# EAGLE design v001 (EAGLE 6.4)

## Sheet 1 of 2
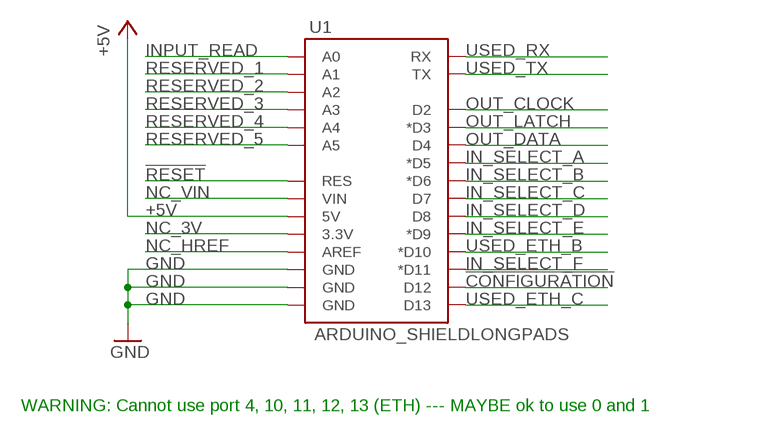
[diagram p0: schematic, sheet 1]

### Parts
U1  ARDUINO_SHIELDLONGPADS  [DUEMILANOVE_SHIELD_LONGPADS]

### Nets
!CONFIGURATION: U1.D12 ; also sheet 2
!RESET: U1.RES ; also sheet 2
+5V: U1.5V ; also sheet 2
GND: U1.GND@0(GND) U1.GND@1(GND) U1.GND@2(GND) ; also sheet 2
IN_SELECT_A: U1.D5(*D5) ; also sheet 2
IN_SELECT_B: U1.D6(*D6) ; also sheet 2
IN_SELECT_C: U1.D7 ; also sheet 2
IN_SELECT_D: U1.D8 ; also sheet 2
IN_SELECT_E: U1.D9(*D9) ; also sheet 2
IN_SELECT_F: U1.D11(*D11) ; also sheet 2
INPUT_READ: U1.A0 ; also sheet 2
NC_3V: U1.3.3V
NC_HREF: U1.AREF
NC_VIN: U1.VIN
OUT_CLOCK: U1.D2 ; also sheet 2
OUT_DATA: U1.D4 ; also sheet 2
OUT_LATCH: U1.D3(*D3) ; also sheet 2
RESERVED_1: U1.A1 ; also sheet 2
RESERVED_2: U1.A2 ; also sheet 2
RESERVED_3: U1.A3 ; also sheet 2
RESERVED_4: U1.A4 ; also sheet 2
RESERVED_5: U1.A5 ; also sheet 2
USED_ETH_B: U1.D10(*D10)
USED_ETH_C: U1.D13
USED_RX: U1.RX
USED_TX: U1.TX

### Notes on the sheet
- WARNING: Cannot use port 4, 10, 11, 12, 13 (ETH) --- MAYBE ok to use 0 and 1

## Sheet 2 of 2
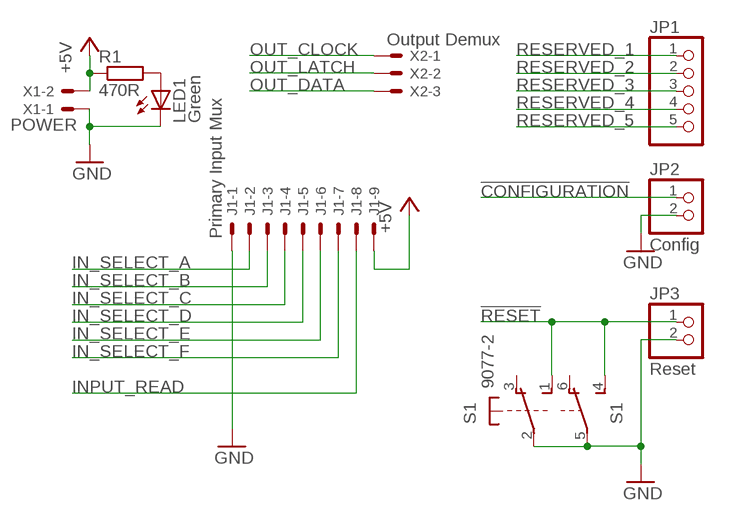
[diagram p1: schematic, sheet 2]

### Parts
J1  Primary Input Mux  22-27-2091-09  [6410-09]
JP1  PINHD-1X5  [1X05]
JP2  Config  PINHD-1X2  [1X02]
JP3  Reset  PINHD-1X2  [1X02]
LED1  Green  LED3MM  [LED3MM]
R1  470R  R-EU_0204/7  [0204/7]
S1  9077-2  [9077-2]
X1  POWER  22-23-2021  [22-23-2021]
X2  Output Demux  22-23-2031  [22-23-2031]

### Nets
!CONFIGURATION: JP2.1 ; also sheet 1
!RESET: JP3.1 S1.1(1:S) S1.4(2:S) ; also sheet 1
+5V: J1.9 R1.1 X1.2 ; also sheet 1
GND: J1.1 JP2.2 JP3.2 LED1.K(C) S1.2(1:P) S1.5(2:P) X1.1 ; also sheet 1
IN_SELECT_A: J1.2 ; also sheet 1
IN_SELECT_B: J1.3 ; also sheet 1
IN_SELECT_C: J1.4 ; also sheet 1
IN_SELECT_D: J1.5 ; also sheet 1
IN_SELECT_E: J1.6 ; also sheet 1
IN_SELECT_F: J1.7 ; also sheet 1
INPUT_READ: J1.8 ; also sheet 1
N$1: LED1.A R1.2
OUT_CLOCK: X2.1 ; also sheet 1
OUT_DATA: X2.3 ; also sheet 1
OUT_LATCH: X2.2 ; also sheet 1
RESERVED_1: JP1.1 ; also sheet 1
RESERVED_2: JP1.2 ; also sheet 1
RESERVED_3: JP1.3 ; also sheet 1
RESERVED_4: JP1.4 ; also sheet 1
RESERVED_5: JP1.5 ; also sheet 1
Unconnected: S1.3(1:O) S1.6(2:O)

## Library data of the parts
J1 = con-molex:22-?-09: CONNECTOR wire to board 2.54 mm (.1 inch) pitch header; OC_FARNELL: unknown; OC_NEWARK: unknown
JP1 = pinhead:PINHD-1X5: PIN HEADER
JP2 JP3 = pinhead:PINHD-1X2: PIN HEADER
LED1 = led:LED: LED OSRAM: - CHIPLED LG R971, LG N971, LY N971, LG Q971, LY Q971, LO R971, LY R971 LH N974, LH R974 LS Q976, LO Q976, LY Q976 LO Q996 - Hyper CHIPLED LW Q18S LB Q993, LB Q99A, LB R99A - SideLED LS A670, LO A670, LY A670, LG A670, LP A670 LB A673, LV A673, LT A673, LW A673 LH A674 LY A675 LS A676, LA A676, LO A676, LY A676, LW A676 LS A679, LY A679, LG A679 - Hyper Micro SIDELED® LS Y876, LA Y876, LO Y876, LY Y876 LT Y87S - SmartLED LW L88C, LW L88S LB L89C, LB L89S, LG L890 LS L89K, LO L89K, LY L89K LS L896, LA L896, LO L896, LY L896 - TOPLED LS T670, LO T670, LY T670, LG T670, LP T670 LSG T670, LSP T670, LSY T670, LOP T670, LYG T670 LG T671, LOG T671, LSG T671 LB T673, LV T673, LT T673, LW T673 LH T674 LS T676, LA T676, LO T676, LY T676, LB T676, LH T676, LSB T676, LW T676 LB T67C, LV T67C, LT T67C, LS T67K, LO T67K, LY T67K, LW E67C LS E67B, LA E67B, LO E67B, LY E67B, LB E67C, LV E67C, LT E67C LW T67C LS T679, LY T679, LG T679 LS T770, LO T770, LY T770, LG T770, LP T770 LB T773, LV T773, LT T773, LW T773 LH T774 LS E675, LA E675, LY E675, LS T675 LS T776, LA T776, LO T776, LY T776, LB T776 LHGB T686 LT T68C, LB T68C - Hyper Mini TOPLED® LB M676 - Mini TOPLED Santana® LG M470 LS M47K, LO M47K, LY M47K Source: http://www.osram.convergy.de LUXEON: - LUMILED® LXK2-PW12-R00, LXK2-PW12-S00, LXK2-PW14-U00, LXK2-PW14-V00 LXK2-PM12-R00, LXK2-PM12-S00, LXK2-PM14-U00 LXK2-PE12-Q00, LXK2-PE12-R00, LXK2-PE12-S00, LXK2-PE14-T00, LXK2-PE14-U00 LXK2-PB12-K00, LXK2-PB12-L00, LXK2-PB12-M00, LXK2-PB14-N00, LXK2-PB14-P00, LXK2-PB14-Q00 LXK2-PR12-L00, LXK2-PR12-M00, LXK2-PR14-Q00, LXK2-PR14-R00 LXK2-PD12-Q00, LXK2-PD12-R00, LXK2-PD12-S00 LXK2-PH12-R00, LXK2-PH12-S00 LXK2-PL12-P00, LXK2-PL12-Q00, LXK2-PL12-R00 Source: www.luxeon.com KINGBRIGHT: KA-3528ASYC Source: www.kingbright.com
R1 = rcl:R-EU_: RESISTOR, European symbol
S1 = switch-misc:9077-2: MARQUARDT SWITCH 9077.0200 Distributor: Buerklin <https://www.buerklin.com/default.asp?event=ShowArtikel%2812G2822%29&l=d&jump=ArtNr_12G2822>
U1 = SparkFun-Boards:ARDUINO_SHIELD: Arduino shield footprint
X1 = con-molex:22-23-2021: .100" (2.54mm) Center Header - 2 Pin; MF: MOLEX; MPN: 22-23-2021; OC_FARNELL: 1462926; OC_NEWARK: 25C3832
X2 = con-molex:22-23-2031: .100" (2.54mm) Center Header - 3 Pin; MF: MOLEX; MPN: 22-23-2031; OC_FARNELL: 1462950; OC_NEWARK: 30C0862

## Board
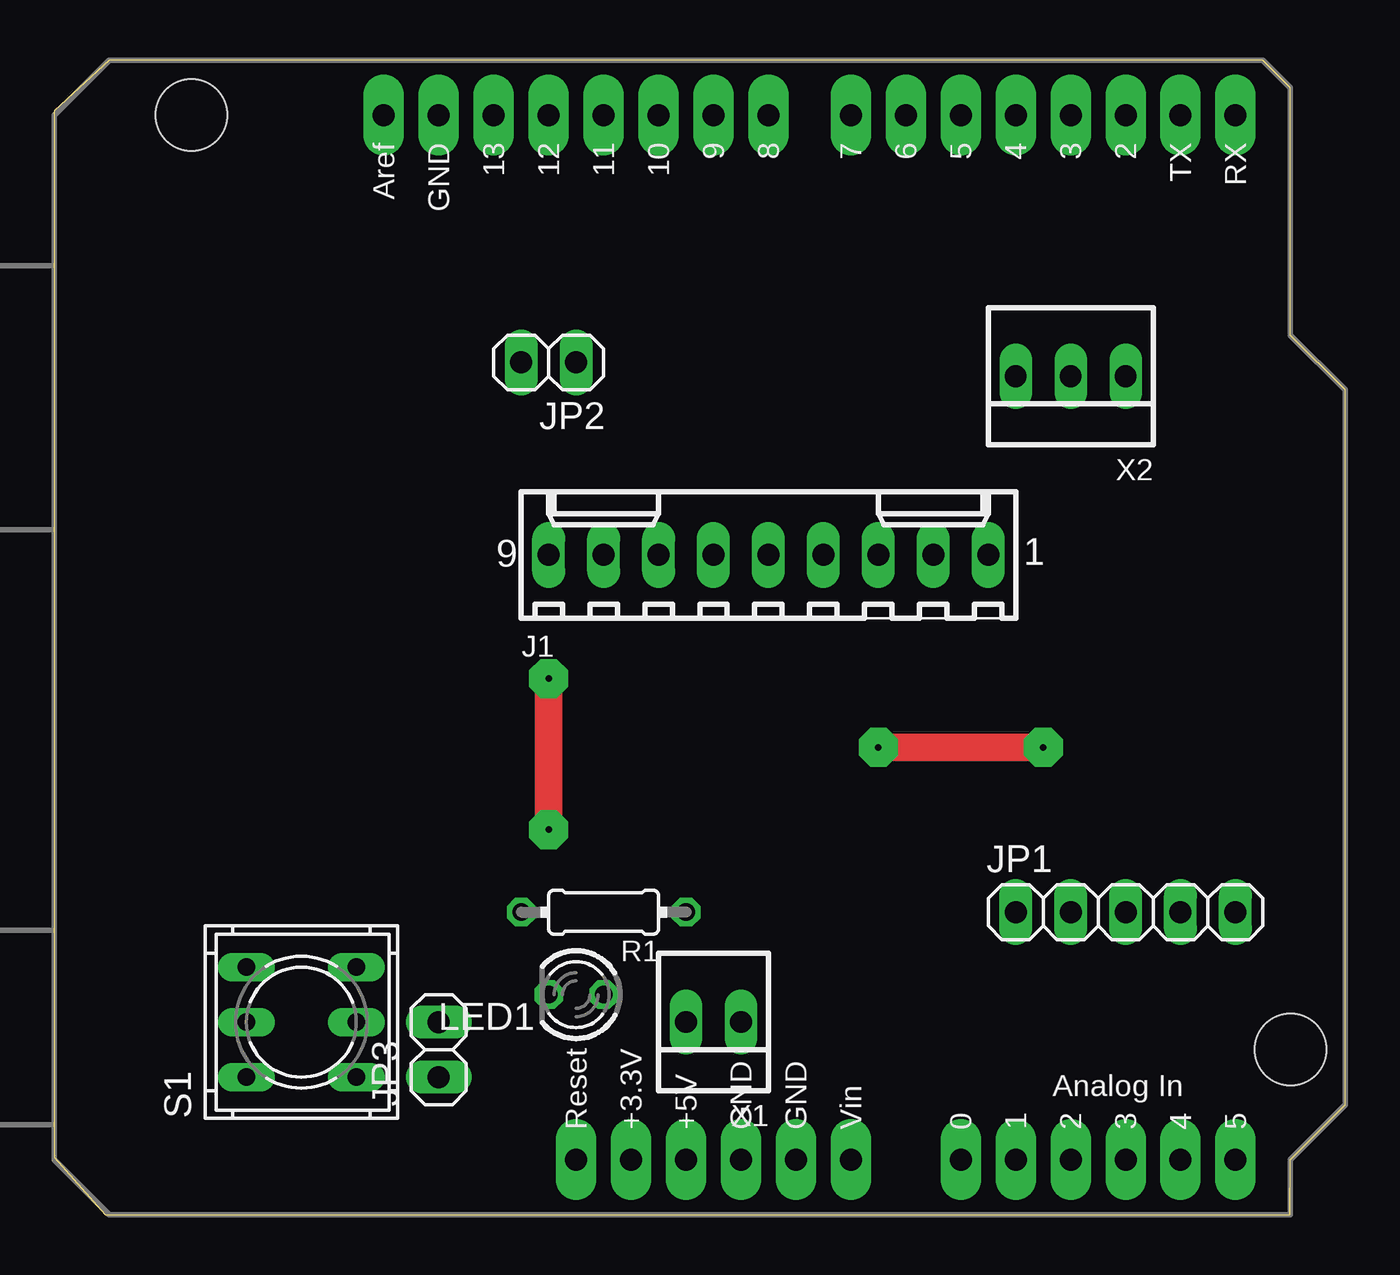
[diagram p2: board, top side]
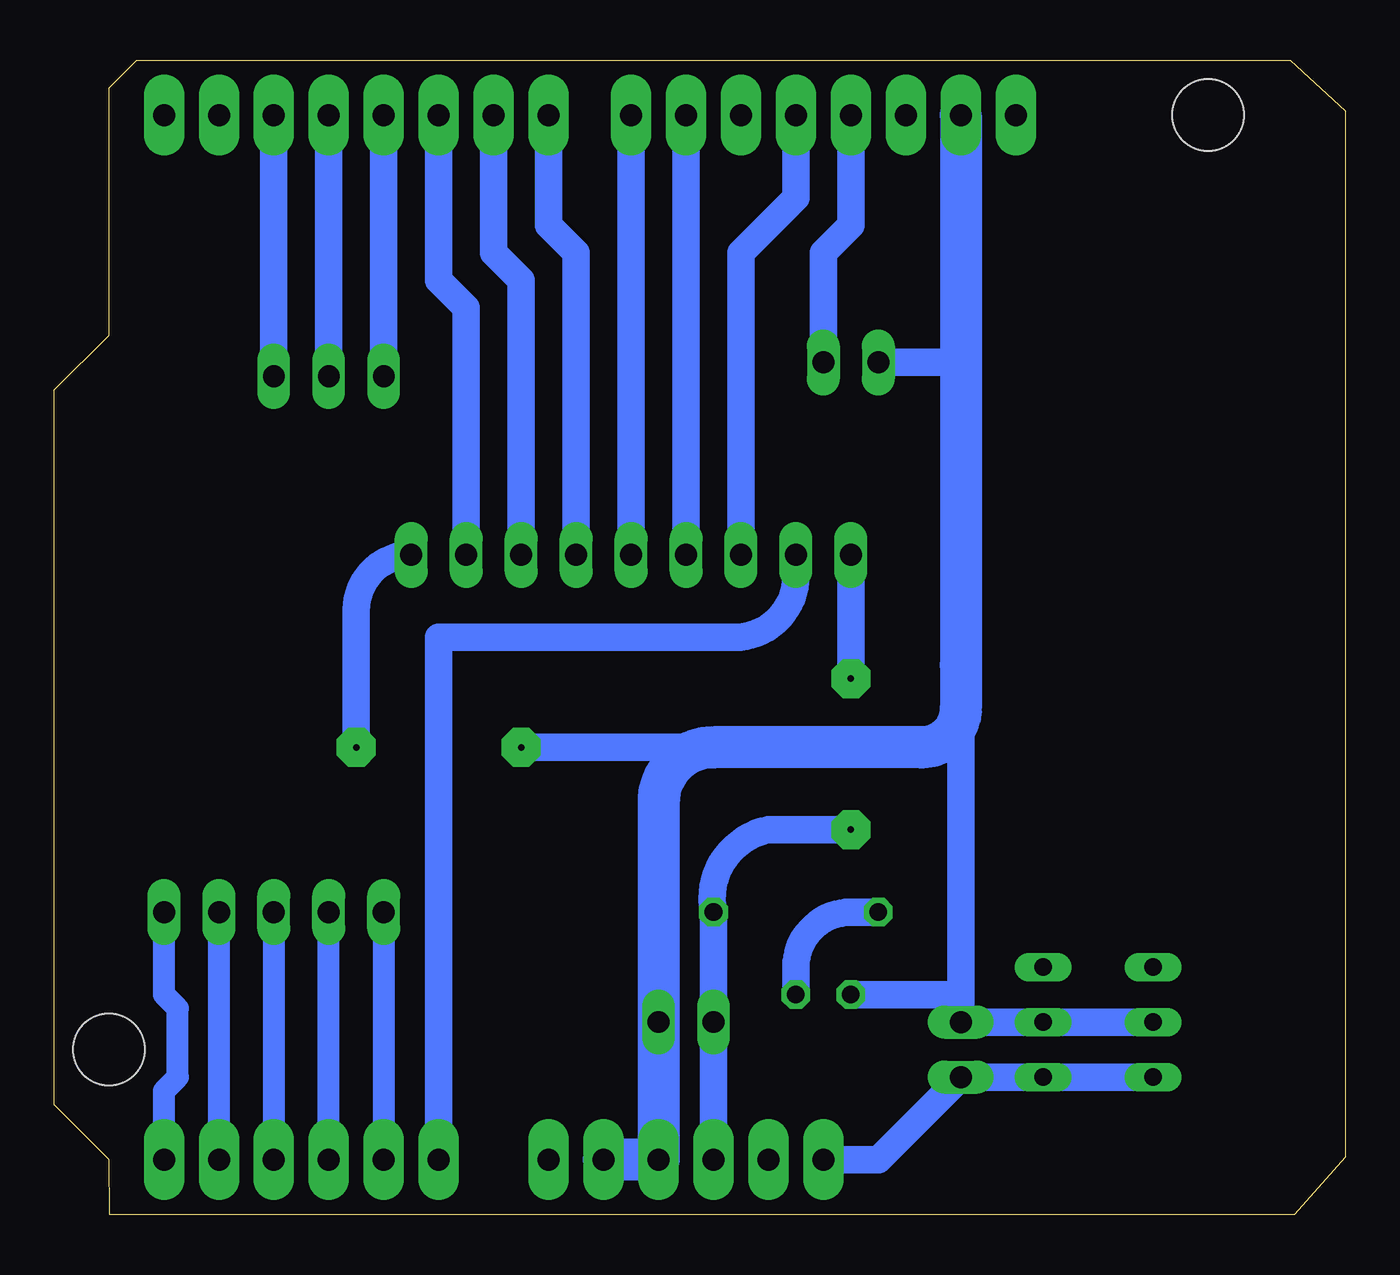
[diagram p3: board, bottom side, seen from below]

Size 59.69 x 53.34 mm. Coordinates in mm from the lower left corner, seen from the top.
Outline: 2.37,0 57.13,0 57.15,2.54 59.69,5.08 59.69,38.1 57.15,40.64 57.15,52.07 55.88,53.34 2.54,53.34 0,51 0,2.63 2.37,0
Copper layers (1*16): Top 0.035mm / dielectric 1.5mm / Bottom 0.035mm
Design rules "default": minimum track width 10mil, minimum drill 24mil, track to track 8mil, track to pad 8mil, pad to pad 8mil, via to via 8mil, smd to smd 8mil, copper to edge 40mil, drill to drill 8mil, minimum pad ring 10mil, minimum via ring 8mil, stop-mask expansion 4mil, vias tented up to drill 0mil, thermal gap 10mil

### Footprints (pad centres in the part's own frame; a part is rotated, then mirrored left to right if it is on the bottom)
6410-09 = drill 1.016 long: 1 10.16,0; 2 7.62,0; 3 5.08,0; 4 2.54,0; 5 0,0; 6 -2.54,0; 7 -5.08,0; 8 -7.62,0; 9 -10.16,0
1X05 = drill 1.016 long: 1 -5.08,0; 2 -2.54,0; 3 0,0; 4 2.54,0; 5 5.08,0
1X02 = drill 1.016 long: 1 -1.27,0; 2 1.27,0
LED3MM = drill 0.813 octagon: A -1.27,0; K 1.27,0
0204/7 = drill 0.813 octagon: 1 -3.81,0; 2 3.81,0
9077-2 = drill 0.813 long: 1 -2.54,2.54; 2 0,2.54; 3 2.54,2.54; 4 -2.54,-2.54; 5 0,-2.54; 6 2.54,-2.54
DUEMILANOVE_SHIELD_LONGPADS = drill 1.016 pad 1.88 long: 3.3V 50.8,26.67; 5V 50.8,29.21; A0 50.8,41.91; A1 50.8,44.45; A2 50.8,46.99; A3 50.8,49.53; A4 50.8,52.07; A5 50.8,54.61; AREF 2.54,15.24; D2 2.54,49.53; D3 2.54,46.99; D4 2.54,44.45; D5 2.54,41.91; D6 2.54,39.37; D7 2.54,36.83; D8 2.54,33.02; D9 2.54,30.48; D10 2.54,27.94; D11 2.54,25.4; D12 2.54,22.86; D13 2.54,20.32; GND@0 50.8,31.75; GND@1 50.8,34.29; GND@2 2.54,17.78; RES 50.8,24.13; RX 2.54,54.61; TX 2.54,52.07; VIN 50.8,36.83 | hole 3.302: 45.72,57.15; 2.54,6.35
22-23-2021 = drill 1 long: 1 -1.27,0; 2 1.27,0
22-23-2031 = drill 1 long: 1 -2.54,0; 2 0,0; 3 2.54,0

### Placement (x,y rotation side)
J1  33.02,30.48 0 top
JP1  49.53,13.97 0 top
JP2  22.86,39.37 180 top
JP3  17.78,7.62 90 top
LED1  24.13,10.16 180 top
R1  25.4,13.97 180 top
S1  11.43,8.89 90 top
U1  0,53.34 270 top
X1  30.48,8.89 180 top
X2  46.99,38.73 180 top

### Tracks (layer width: path | path; a pad name or v marks a point on that pad's centre or on a via)
!CONFIGURATION
  Bottom 1.27: JP2.1 24.13,44.45 22.86,45.72 U1.D12
!RESET
  Bottom 1.27: U1.RES 21.59,2.54 JP3.1 S1.4 S1.1
+5V  (via drill 0.3 pad 1.8)
  Top 1.27: v22.86,17.78 v22.86,24.77
  Bottom 1.27: U1.5V X1.2 R1.1 arc90 26.67,17.78 v22.86,17.78 | v22.86,24.77 J1.9
GND  (via drill 0.3 pad 1.8)
  Top 1.27: v45.72,21.59 v38.1,21.59
  Bottom 1.27: JP2.2 17.78,39.37 | 17.78,10.16 JP3.2 S1.5 S1.2 | 17.78,10.16 17.78,25.4 | LED1.K 17.78,10.16 | J1.1 arc-90 45.72,27.94 v45.72,21.59 | v38.1,21.59 29.21,21.59
  Bottom 1.93: U1.GND@2 17.78,39.37 17.78,25.4 17.78,23.39 arc90 19.58,21.59 29.21,21.59 arc-90 31.75,19.05 X1.1 U1.GND@0 U1.GND@1
IN_SELECT_A
  Bottom 1.27: U1.D5 41.91,43.18 40.64,41.91 J1.2
IN_SELECT_B
  Bottom 1.27: U1.D6 39.37,44.45 38.1,43.18 J1.3
IN_SELECT_C
  Bottom 1.27: U1.D7 36.83,45.72 35.56,44.45 J1.4
IN_SELECT_D
  Bottom 1.27: J1.5 U1.D8
IN_SELECT_E
  Bottom 1.27: U1.D9 J1.6
IN_SELECT_F
  Bottom 1.27: U1.D11 25.4,46.99 27.94,44.45 J1.7
INPUT_READ
  Bottom 1.27: J1.8 25.4,29.51 arc90 28.24,26.67 41.91,26.67 U1.A0
N$1
  Bottom 1.27: R1.2 22.86,13.97 arc-90 25.4,11.43 LED1.A
OUT_CLOCK
  Bottom 1.27: U1.D2 X2.1
OUT_DATA
  Bottom 1.27: U1.D4 X2.3
OUT_LATCH
  Bottom 1.27: U1.D3 X2.2
RESERVED_1
  Bottom 1.016: JP1.1 U1.A1
RESERVED_2
  Bottom 1.016: U1.A2 JP1.2
RESERVED_3
  Bottom 1.016: JP1.3 U1.A3
RESERVED_4
  Bottom 1.016: U1.A4 JP1.4
RESERVED_5
  Bottom 1.016: U1.A5 54.61,5.71 53.98,6.35 53.98,9.53 54.61,10.16 JP1.5